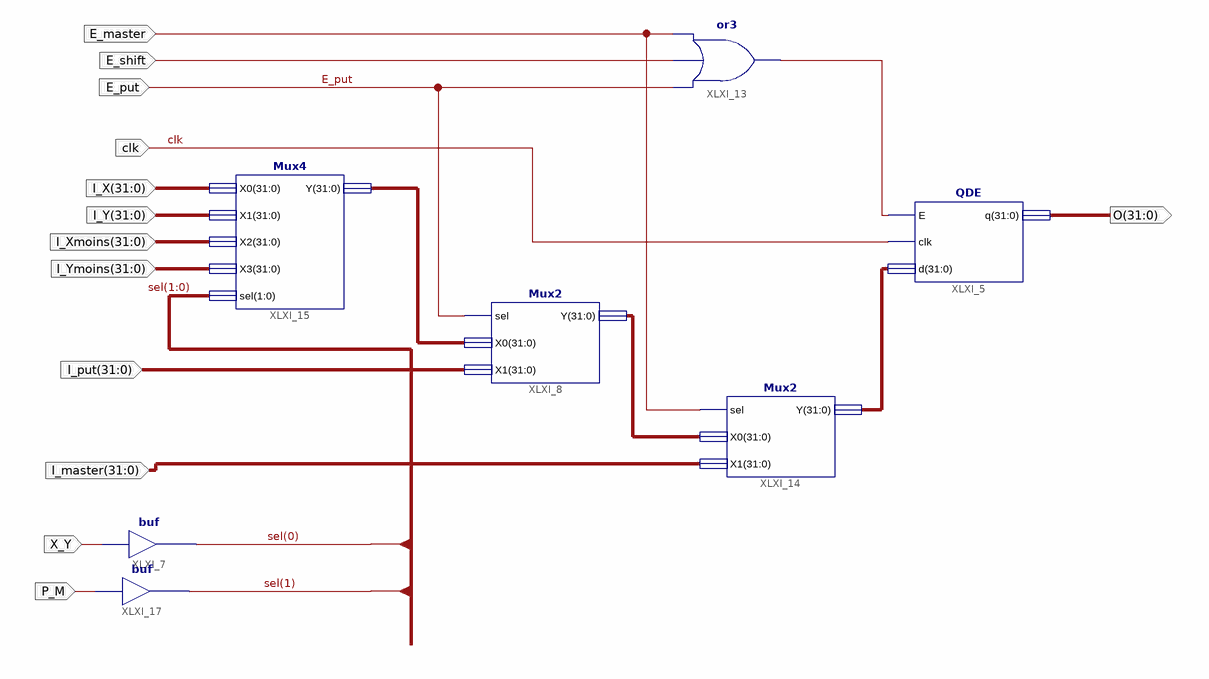
[diagram p0: schematic sheet 1]
// Xilinx ISE schematic netring_master.sch (spartan6) as structural Verilog: 7 symbols, 13 ports
module netring_master (
  input  clk,
  input  [31:0] I_put,
  input  E_shift,
  input  E_put,
  input  E_master,
  input  [31:0] I_master,
  input  [31:0] I_Y,
  input  [31:0] I_X,
  input  [31:0] I_Xmoins,
  input  [31:0] I_Ymoins,
  input  P_M,
  input  X_Y,
  output [31:0] O
);

  wire XLXN_19;
  wire [1:0] sel;
  wire [31:0] XLXN_28, XLXN_47, XLXN_48;

  Mux2 XLXI_8 (.sel(E_put), .X0(XLXN_28), .X1(I_put), .Y(XLXN_47));
  or XLXI_13 (XLXN_19, E_put, E_shift, E_master);
  Mux2 XLXI_14 (.sel(E_master), .X0(XLXN_47), .X1(I_master), .Y(XLXN_48));
  QDE XLXI_5 (.E(XLXN_19), .clk(clk), .d(XLXN_48), .q(O));
  Mux4 XLXI_15 (.X0(I_X), .X1(I_Y), .X2(I_Xmoins), .X3(I_Ymoins), .sel(sel), .Y(XLXN_28));
  buf XLXI_7 (sel[0], X_Y);
  buf XLXI_17 (sel[1], P_M);
endmodule
